# EAGLE design d100_zm1000_rev_b (EAGLE 6.1)
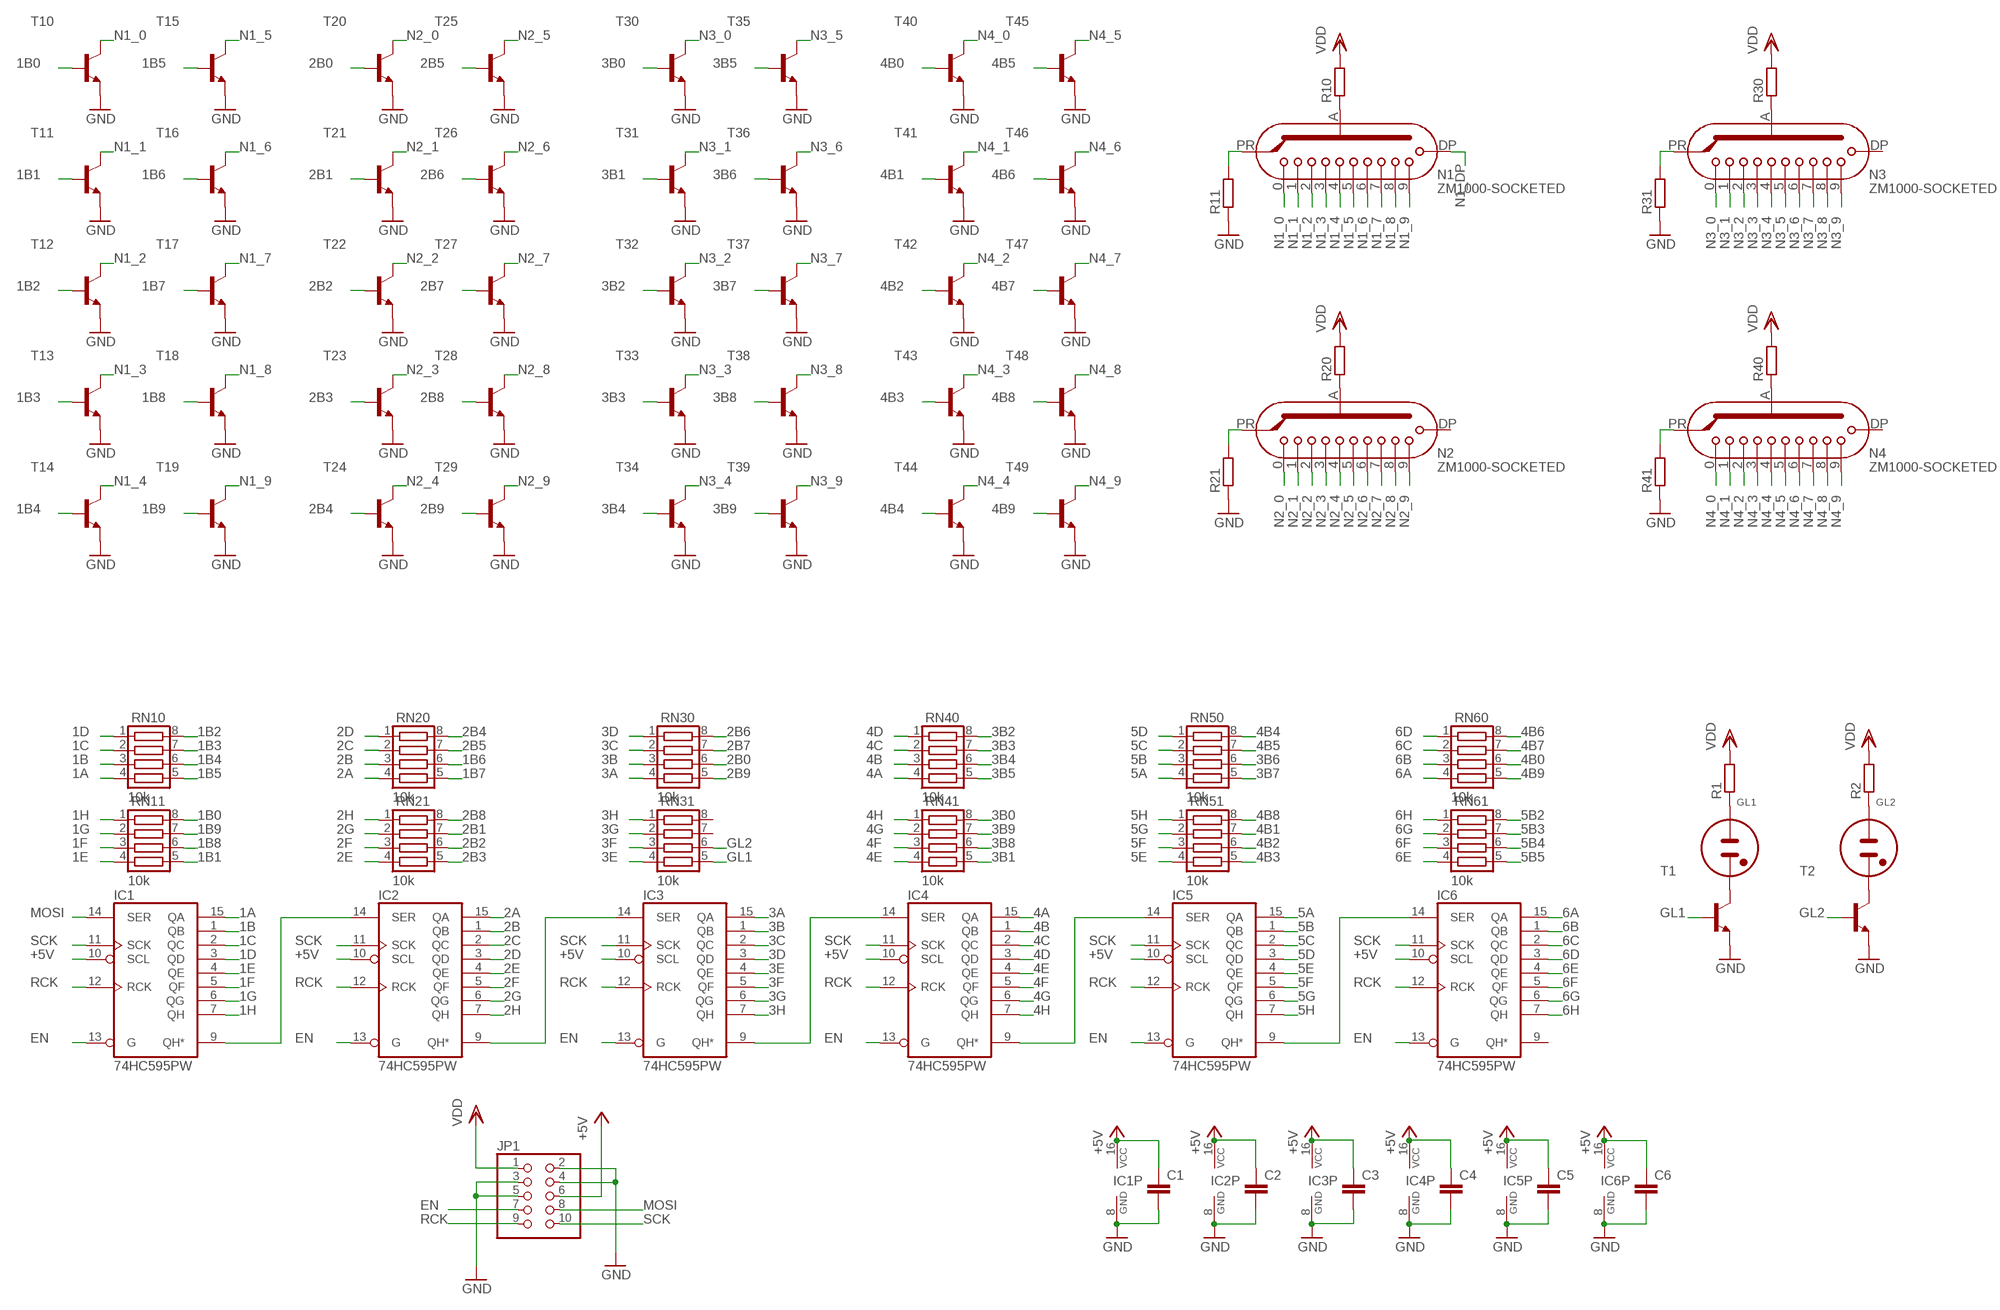
[diagram p0: schematic, sheet 1]

## Parts
C1  C-EUC0603  [C0603]
C2  C-EUC0603  [C0603]
C3  C-EUC0603  [C0603]
C4  C-EUC0603  [C0603]
C5  C-EUC0603  [C0603]
C6  C-EUC0603  [C0603]
GL1  NE2-NEON-BULB-DRILL  [NE2-NEON-BULB-DRILL]
GL2  NE2-NEON-BULB-DRILL  [NE2-NEON-BULB-DRILL]
IC1  74HC595PW  [TSSOP16]
IC2  74HC595PW  [TSSOP16]
IC3  74HC595PW  [TSSOP16]
IC4  74HC595PW  [TSSOP16]
IC5  74HC595PW  [TSSOP16]
IC6  74HC595PW  [TSSOP16]
JP1  PINHD-2X5_2.54-SMD  [2X05SMD]
N1  ZM1000-SOCKETED  [ZM1000-SOCKETED]
N2  ZM1000-SOCKETED  [ZM1000-SOCKETED]
N3  ZM1000-SOCKETED  [ZM1000-SOCKETED]
N4  ZM1000-SOCKETED  [ZM1000-SOCKETED]
R1  R-EU_R0603  [R0603]
R2  R-EU_R0603  [R0603]
R10  R-EU_R0603  [R0603]
R11  R-EU_R0603  [R0603]
R20  R-EU_R0603  [R0603]
R21  R-EU_R0603  [R0603]
R30  R-EU_R0603  [R0603]
R31  R-EU_R0603  [R0603]
R40  R-EU_R0603  [R0603]
R41  R-EU_R0603  [R0603]
RN10  10k  CTS742C083  [CTS742C083]
RN11  10k  CTS742C083  [CTS742C083]
RN20  10k  CTS742C083  [CTS742C083]
RN21  10k  CTS742C083  [CTS742C083]
RN30  10k  CTS742C083  [CTS742C083]
RN31  10k  CTS742C083  [CTS742C083]
RN40  10k  CTS742C083  [CTS742C083]
RN41  10k  CTS742C083  [CTS742C083]
RN50  10k  CTS742C083  [CTS742C083]
RN51  10k  CTS742C083  [CTS742C083]
RN60  10k  CTS742C083  [CTS742C083]
RN61  10k  CTS742C083  [CTS742C083]
T1  SMBTA42  [SOT23]
T2  SMBTA42  [SOT23]
T10  SMBTA42  [SOT23]
T11  SMBTA42  [SOT23]
T12  SMBTA42  [SOT23]
T13  SMBTA42  [SOT23]
T14  SMBTA42  [SOT23]
T15  SMBTA42  [SOT23]
T16  SMBTA42  [SOT23]
T17  SMBTA42  [SOT23]
T18  SMBTA42  [SOT23]
T19  SMBTA42  [SOT23]
T20  SMBTA42  [SOT23]
T21  SMBTA42  [SOT23]
T22  SMBTA42  [SOT23]
T23  SMBTA42  [SOT23]
T24  SMBTA42  [SOT23]
T25  SMBTA42  [SOT23]
T26  SMBTA42  [SOT23]
T27  SMBTA42  [SOT23]
T28  SMBTA42  [SOT23]
T29  SMBTA42  [SOT23]
T30  SMBTA42  [SOT23]
T31  SMBTA42  [SOT23]
T32  SMBTA42  [SOT23]
T33  SMBTA42  [SOT23]
T34  SMBTA42  [SOT23]
T35  SMBTA42  [SOT23]
T36  SMBTA42  [SOT23]
T37  SMBTA42  [SOT23]
T38  SMBTA42  [SOT23]
T39  SMBTA42  [SOT23]
T40  SMBTA42  [SOT23]
T41  SMBTA42  [SOT23]
T42  SMBTA42  [SOT23]
T43  SMBTA42  [SOT23]
T44  SMBTA42  [SOT23]
T45  SMBTA42  [SOT23]
T46  SMBTA42  [SOT23]
T47  SMBTA42  [SOT23]
T48  SMBTA42  [SOT23]
T49  SMBTA42  [SOT23]

## Nets
1A: IC1.15(QA) RN10.4
1B: IC1.1(QB) RN10.3
1B0: RN11.8 T10.1(B)
1B1: RN11.5 T11.1(B)
1B2: RN10.8 T12.1(B)
1B3: RN10.7 T13.1(B)
1B4: RN10.6 T14.1(B)
1B5: RN10.5 T15.1(B)
1B6: RN20.6 T16.1(B)
1B7: RN20.5 T17.1(B)
1B8: RN11.6 T18.1(B)
1B9: RN11.7 T19.1(B)
1C: IC1.2(QC) RN10.2
1D: IC1.3(QD) RN10.1
1E: IC1.4(QE) RN11.4
1F: IC1.5(QF) RN11.3
1G: IC1.6(QG) RN11.2
1H: IC1.7(QH) RN11.1
2A: IC2.15(QA) RN20.4
2B: IC2.1(QB) RN20.3
2B0: RN30.6 T20.1(B)
2B1: RN21.7 T21.1(B)
2B2: RN21.6 T22.1(B)
2B3: RN21.5 T23.1(B)
2B4: RN20.8 T24.1(B)
2B5: RN20.7 T25.1(B)
2B6: RN30.8 T26.1(B)
2B7: RN30.7 T27.1(B)
2B8: RN21.8 T28.1(B)
2B9: RN30.5 T29.1(B)
2C: IC2.2(QC) RN20.2
2D: IC2.3(QD) RN20.1
2E: IC2.4(QE) RN21.4
2F: IC2.5(QF) RN21.3
2G: IC2.6(QG) RN21.2
2H: IC2.7(QH) RN21.1
3A: IC3.15(QA) RN30.4
3B: IC3.1(QB) RN30.3
3B0: RN41.8 T30.1(B)
3B1: RN41.5 T31.1(B)
3B2: RN40.8 T32.1(B)
3B3: RN40.7 T33.1(B)
3B4: RN40.6 T34.1(B)
3B5: RN40.5 T35.1(B)
3B6: RN50.6 T36.1(B)
3B7: RN50.5 T37.1(B)
3B8: RN41.6 T38.1(B)
3B9: RN41.7 T39.1(B)
3C: IC3.2(QC) RN30.2
3D: IC3.3(QD) RN30.1
3E: IC3.4(QE) RN31.4
3F: IC3.5(QF) RN31.3
3G: IC3.6(QG) RN31.2
3H: IC3.7(QH) RN31.1
4A: IC4.15(QA) RN40.4
4B: IC4.1(QB) RN40.3
4B0: RN60.6 T40.1(B)
4B1: RN51.7 T41.1(B)
4B2: RN51.6 T42.1(B)
4B3: RN51.5 T43.1(B)
4B4: RN50.8 T44.1(B)
4B5: RN50.7 T45.1(B)
4B6: RN60.8 T46.1(B)
4B7: RN60.7 T47.1(B)
4B8: RN51.8 T48.1(B)
4B9: RN60.5 T49.1(B)
4C: IC4.2(QC) RN40.2
4D: IC4.3(QD) RN40.1
4E: IC4.4(QE) RN41.4
4F: IC4.5(QF) RN41.3
4G: IC4.6(QG) RN41.2
4H: IC4.7(QH) RN41.1
5A: IC5.15(QA) RN50.4
5B: IC5.1(QB) RN50.3
5B2: RN61.8
5B3: RN61.7
5B4: RN61.6
5B5: RN61.5
5C: IC5.2(QC) RN50.2
5D: IC5.3(QD) RN50.1
5E: IC5.4(QE) RN51.4
5F: IC5.5(QF) RN51.3
5G: IC5.6(QG) RN51.2
5H: IC5.7(QH) RN51.1
6A: IC6.15(QA) RN60.4
6B: IC6.1(QB) RN60.3
6C: IC6.2(QC) RN60.2
6D: IC6.3(QD) RN60.1
6E: IC6.4(QE) RN61.4
6F: IC6.5(QF) RN61.3
6G: IC6.6(QG) RN61.2
6H: IC6.7(QH) RN61.1
+5V: C1.1 C2.1 C3.1 C4.1 C5.1 C6.1 IC1.10(SCL) IC1.16(VCC) IC2.10(SCL) IC2.16(VCC) IC3.10(SCL) IC3.16(VCC) IC4.10(SCL) IC4.16(VCC) IC5.10(SCL) IC5.16(VCC) IC6.10(SCL) IC6.16(VCC) JP1.6
EN: IC1.13(G) IC2.13(G) IC3.13(G) IC4.13(G) IC5.13(G) IC6.13(G) JP1.7
GL1: RN31.5 T1.1(B)
GL2: RN31.6 T2.1(B)
GND: C1.2 C2.2 C3.2 C4.2 C5.2 C6.2 IC1.8(GND) IC2.8(GND) IC3.8(GND) IC4.8(GND) IC5.8(GND) IC6.8(GND) JP1.2 JP1.3 JP1.4 JP1.5 R11.1 R21.1 R31.1 R41.1 T1.2(E) T2.2(E) T10.2(E) T11.2(E) T12.2(E) T13.2(E) T14.2(E) T15.2(E) T16.2(E) T17.2(E) T18.2(E) T19.2(E) T20.2(E) T21.2(E) T22.2(E) T23.2(E) T24.2(E) T25.2(E) T26.2(E) T27.2(E) T28.2(E) T29.2(E) T30.2(E) T31.2(E) T32.2(E) T33.2(E) T34.2(E) T35.2(E) T36.2(E) T37.2(E) T38.2(E) T39.2(E) T40.2(E) T41.2(E) T42.2(E) T43.2(E) T44.2(E) T45.2(E) T46.2(E) T47.2(E) T48.2(E) T49.2(E)
MOSI: IC1.14(SER) JP1.8
N1_0: N1.K0 T10.3(C)
N1_1: N1.K1 T11.3(C)
N1_2: N1.K2 T12.3(C)
N1_3: N1.K3 T13.3(C)
N1_4: N1.K4 T14.3(C)
N1_5: N1.K5 T15.3(C)
N1_6: N1.K6 T16.3(C)
N1_7: N1.K7 T17.3(C)
N1_8: N1.K8 T18.3(C)
N1_9: N1.K9 T19.3(C)
N1_DP: N1.KDP(DP)
N1_PR: N1.PR R11.2
N2_0: N2.K0 T20.3(C)
N2_1: N2.K1 T21.3(C)
N2_2: N2.K2 T22.3(C)
N2_3: N2.K3 T23.3(C)
N2_4: N2.K4 T24.3(C)
N2_5: N2.K5 T25.3(C)
N2_6: N2.K6 T26.3(C)
N2_7: N2.K7 T27.3(C)
N2_8: N2.K8 T28.3(C)
N2_9: N2.K9 T29.3(C)
N3_0: N3.K0 T30.3(C)
N3_1: N3.K1 T31.3(C)
N3_2: N3.K2 T32.3(C)
N3_3: N3.K3 T33.3(C)
N3_4: N3.K4 T34.3(C)
N3_5: N3.K5 T35.3(C)
N3_6: N3.K6 T36.3(C)
N3_7: N3.K7 T37.3(C)
N3_8: N3.K8 T38.3(C)
N3_9: N3.K9 T39.3(C)
N4_0: N4.K0 T40.3(C)
N4_1: N4.K1 T41.3(C)
N4_2: N4.K2 T42.3(C)
N4_3: N4.K3 T43.3(C)
N4_4: N4.K4 T44.3(C)
N4_5: N4.K5 T45.3(C)
N4_6: N4.K6 T46.3(C)
N4_7: N4.K7 T47.3(C)
N4_8: N4.K8 T48.3(C)
N4_9: N4.K9 T49.3(C)
N$1: GL2.1(A) R2.1
N$4: N1.A1(A) N1.A2(A) R10.1
N$5: GL2.2(A1) T2.3(C)
N$6: GL1.2(A1) T1.3(C)
N$9: N2.A1(A) N2.A2(A) R20.1
N$10: IC1.9(QH*) IC2.14(SER)
N$11: IC2.9(QH*) IC3.14(SER)
N$12: IC3.9(QH*) IC4.14(SER)
N$13: N3.A1(A) N3.A2(A) R30.1
N$14: N4.A1(A) N4.A2(A) R40.1
N$16: IC4.9(QH*) IC5.14(SER)
N$18: IC5.9(QH*) IC6.14(SER)
N$21: GL1.1(A) R1.1
N$26: N3.PR R31.2
N$27: N2.PR R21.2
N$29: N4.PR R41.2
RCK: IC1.12(RCK) IC2.12(RCK) IC3.12(RCK) IC4.12(RCK) IC5.12(RCK) IC6.12(RCK) JP1.9
SCK: IC1.11(SCK) IC2.11(SCK) IC3.11(SCK) IC4.11(SCK) IC5.11(SCK) IC6.11(SCK) JP1.10
VDD: JP1.1 R1.2 R2.2 R10.2 R20.2 R30.2 R40.2
Unconnected: IC6.9(QH*) N2.KDP(DP) N3.KDP(DP) N4.KDP(DP) RN31.7 RN31.8

## Library data of the parts
C1-C6 = rcl:C-EU: CAPACITOR, European symbol
GL1 GL2 = nixie_tube:NE2-NEON-BULB: Neon indicator (wire connection)
IC1-IC6 = 74xx-eu:74*595: 8-bit SHIFT REGISTER, output latch
JP1 = con-pinhead:PINHD-2X5: PIN HEADER
N1-N4 = nixietubes-western:ZM1000: Cold cathode, neon filled, side viewing indicator tubes with long life expectancy. The ZM1000R is coated with a red filter to improve the contrast of display. These tubes incorporate a decimal point and are fitted with a pin base to suid the standard grid (2.54mm). A primer allows ionisation without delay in strobe type or blanking applications. Numeral height: 14 mm Minimum distance between mounting centres: 19 mm Numerals: 1 2 3 4 5 6 7 8 9 0 Decimal point: to the left of the numerals Cathode current, average: 2.5 mA, maximum peak: 12mA Minimum supply voltage: 170 V
R1 R2 R10 R11 R20 R21 R30 R31 R40 R41 = rcl:R-EU_: RESISTOR, European symbol
RN10 RN11 RN20 RN21 RN30 RN31 RN40 RN41 RN50 RN51 RN60 RN61 = resistor-net:CTS742C083: Chip Resistor Array 4 Single Resistor Source: http://www.ctscorp.com/components/Datasheets/CTSChipArrayDs.pdf; OC_FARNELL: unknown; OC_NEWARK: unknown
T1 T2 T10-T49 = transistor-hv:SMBTA42

## Board
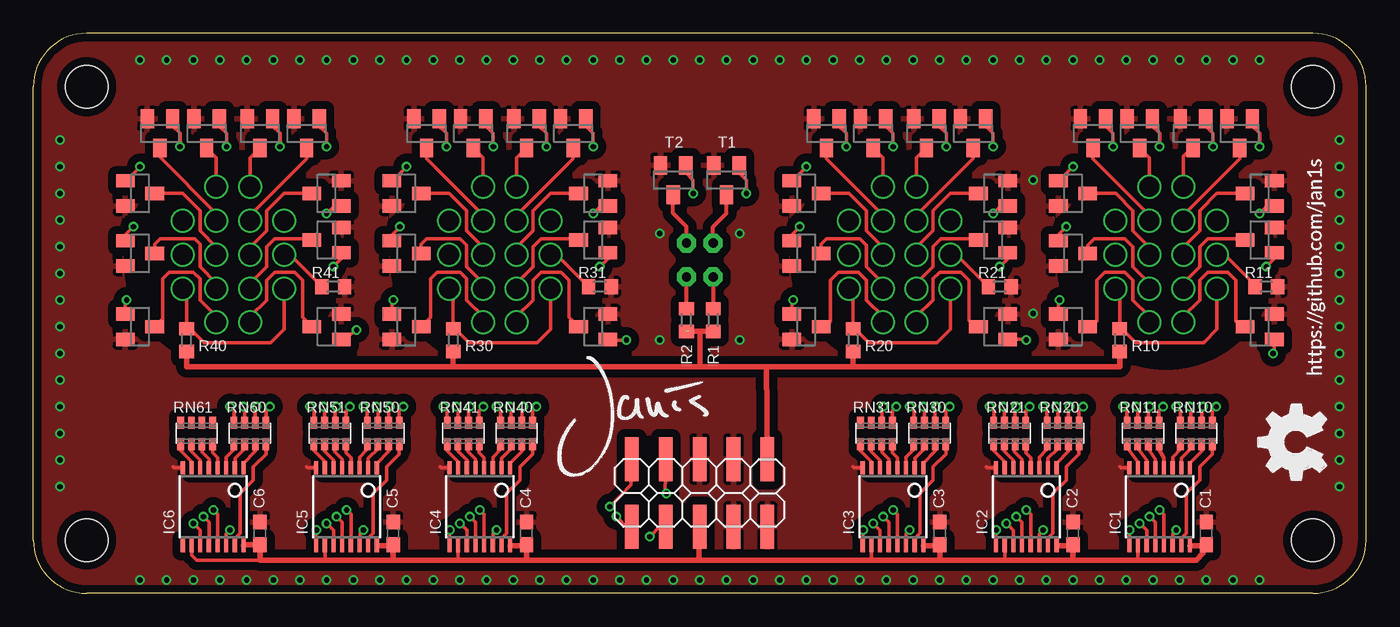
[diagram p1: board, top side]
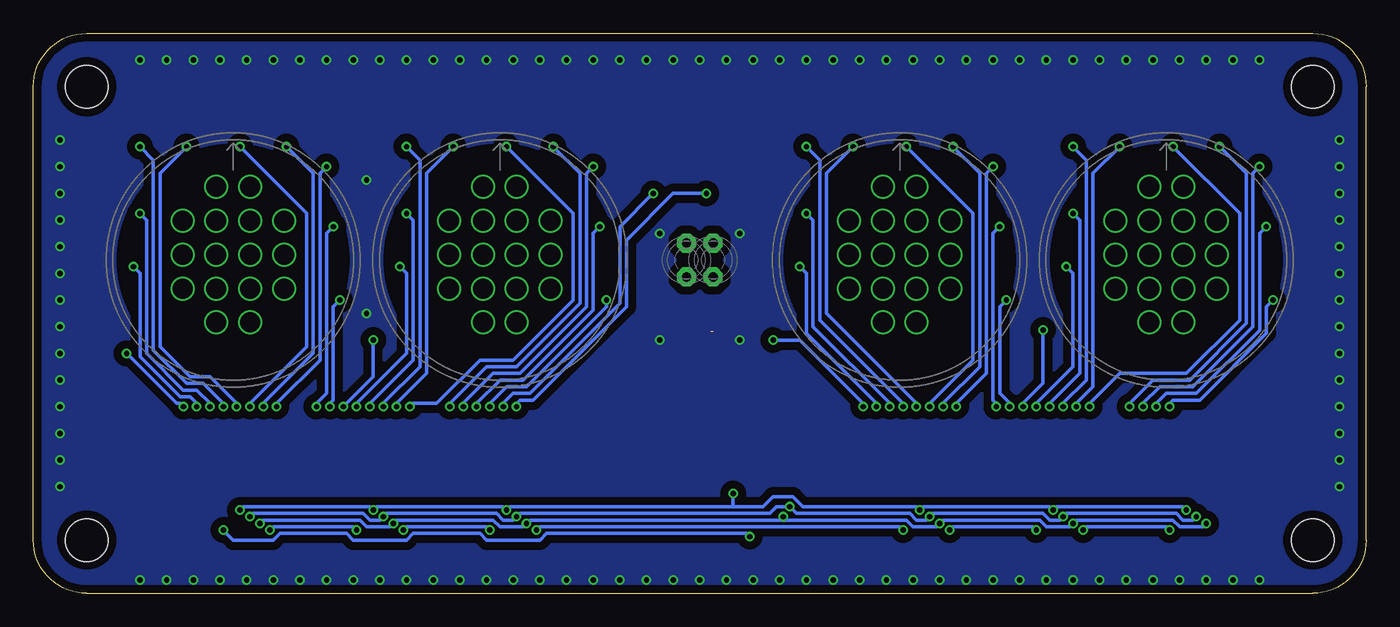
[diagram p2: board, bottom side, seen from below]

Size 100 x 42 mm. Coordinates in mm from the lower left corner, seen from the top.
Outline: 96,0 4,0 arc-90 0,4 0,38 arc-90 4,42 96,42 arc-90 100,38 100,4 arc-90 96,0
Copper layers (1*16): Top 0.035mm / dielectric 1.5mm / Bottom 0.035mm
Design rules: minimum track width 6mil, minimum drill 12mil, track to track 6mil, track to pad 6mil, pad to pad 6mil, via to via 6mil, smd to smd 0mil, copper to edge 10mil, drill to drill 10mil, minimum pad ring 6mil, minimum via ring 6mil, stop-mask expansion 2mil, vias tented up to drill 100mil, thermal gap 10mil
Holes 3.2 mm at 96,4 96,38 4,38 4,4
tRestrict: area 7.5,17.5 to 22.5,32.5; area 27.5,17.5 to 42.5,32.5; area 57.5,17.5 to 72.5,32.5; area 77.5,17.5 to 92.5,32.5
bRestrict: area 7,17 to 23,33; area 27,17 to 43,33; area 57,17 to 73,33; area 77,17 to 93,33

### Footprints (pad centres in the part's own frame; a part is rotated, then mirrored left to right if it is on the bottom)
C0603 = smd 1.1 x 1: 1 -0.85,0; 2 0.85,0
NE2-NEON-BULB-DRILL = drill 0.7 pad 1.422 octagon: 1 0,1.27; 2 0,-1.27
TSSOP16 = smd 0.305 x 0.991: 1 -2.275,-2.918; 2 -1.625,-2.918; 3 -0.975,-2.918; 4 -0.325,-2.918; 5 0.325,-2.918; 6 0.975,-2.918; 7 1.625,-2.918; 8 2.275,-2.918; 9 2.275,2.918; 10 1.625,2.918; 11 0.975,2.918; 12 0.325,2.918; 13 -0.325,2.918; 14 -0.975,2.918; 15 -1.625,2.918; 16 -2.275,2.918
2X05SMD = smd 1.016 x 3.302: 1 -1.27,-3.81; 2 -1.27,1.27; 3 1.27,-3.81; 4 1.27,1.27; 5 3.81,-3.81; 6 3.81,1.27; 7 6.35,-3.81; 8 6.35,1.27; 9 8.89,-3.81; 10 8.89,1.27
ZM1000-SOCKETED = drill 1.5 pad 1.8: A1 -3.81,-2.14; A2 3.81,-2.14; IC1 -3.81,2.94; IC2 3.81,2.94; K0 1.27,0.4; K1 -1.27,5.48; K2 -1.27,2.94; K3 -1.27,0.4; K4 -1.27,-2.14; K5 -1.27,-4.68; K6 1.27,-4.68; K7 1.27,-2.14; K8 1.27,5.48; K9 1.27,2.94; KDP 3.81,0.4; PR -3.81,0.4
R0603 = smd 1 x 1.1: 1 -0.85,0; 2 0.85,0
CTS742C083 = smd 0.5 x 0.9: 1 -1.2,-0.8; 2 -0.4,-0.8; 3 0.4,-0.8; 4 1.2,-0.8; 5 1.2,0.8; 6 0.4,0.8; 7 -0.4,0.8; 8 -1.2,0.8
SOT23 = smd 1 x 1.4: 1 -0.95,-1.1; 2 0.95,-1.1; 3 0,1.1

### Placement (x,y rotation side)
C1  88,4.5 90 top
C2  78,4.5 90 top
C3  68,4.5 90 top
C4  37,4.5 90 top
C5  27,4.5 90 top
C6  17,4.5 90 top
GL1  51,25 180 bottom
GL2  49,25 180 bottom
IC1  84.5,6.5 180 top
IC2  74.5,6.5 180 top
IC3  64.5,6.5 180 top
IC4  33.5,6.5 180 top
IC5  23.5,6.5 180 top
IC6  13.5,6.5 180 top
JP1  53.8,6.25 180 top
N1  85,25 0 bottom
N2  65,25 0 bottom
N3  35,25 0 bottom
N4  15,25 0 bottom
R1  51,20.5 270 top
R2  49,20.5 270 top
R10  81.5,19 270 top
R11  92.5,23 180 top
R20  61.5,19 270 top
R21  72.5,23 180 top
R30  31.5,19 270 top
R31  42.5,23 180 top
R40  11.5,19 270 top
R41  22.5,23 180 top
RN10  87.25,12 0 top
RN11  83.25,12 0 top
RN20  77.25,12 0 top
RN21  73.25,12 0 top
RN30  67.25,12 0 top
RN31  63.25,12 0 top
RN40  36.25,12 0 top
RN41  32.25,12 0 top
RN50  26.25,12 0 top
RN51  22.25,12 0 top
RN60  16.25,12 0 top
RN61  12.25,12 0 top
T1  52,31 180 top
T2  48,31 180 top
T10  78,30 270 top
T11  87,34.5 180 top
T12  90.5,34.5 180 top
T13  92,30 90 top
T14  92,26.5 90 top
T15  92,20 90 top
T16  78,20 270 top
T17  78,25.5 270 top
T18  83,34.5 180 top
T19  79.5,34.5 180 top
T20  58,30 270 top
T21  67,34.5 180 top
T22  70.5,34.5 180 top
T23  72,30 90 top
T24  72,26.5 90 top
T25  72,20 90 top
T26  58,20 270 top
T27  58,25.5 270 top
T28  63,34.5 180 top
T29  59.5,34.5 180 top
T30  28,30 270 top
T31  37,34.5 180 top
T32  40.5,34.5 180 top
T33  42,30 90 top
T34  42,26.5 90 top
T35  42,20 90 top
T36  28,20 270 top
T37  28,25.5 270 top
T38  33,34.5 180 top
T39  29.5,34.5 180 top
T40  8,30 270 top
T41  17,34.5 180 top
T42  20.5,34.5 180 top
T43  22,30 90 top
T44  22,26.5 90 top
T45  22,20 90 top
T46  8,20 270 top
T47  8,25.5 270 top
T48  13,34.5 180 top
T49  9.5,34.5 180 top
U$1  [GITHUB/JAN1S]  96.75,16.25 90 top
U$2  [JANIS_10MM]  39,8.5 0 top
U$3  [OSHW_FILLX200_NOTEXT]  97,8.5 90 top

### Tracks (layer width: path | path; a pad name or v marks a point on that pad's centre or on a via)
1A
  Top 0.254: RN10.4 88.45,10.45 87.5,9.5 87.5,8.5 86.5,7.5 86.5,4.5 86.12,4.12 IC1.15
1B
  Top 0.254: 87.69,11.15 RN10.3 87.65,10.65 86.78,9.78 IC1.1
1B0  (via drill 0.4)
  Top 0.254: RN11.8 82.05,13.7 v81.75,14 | T10.1 76.95,30.95 v78,32
  Bottom 0.254: v78,32 78.5,31.5 78.5,17.5 81.75,14.25 v81.75,14
1B1  (via drill 0.4)
  Top 0.254: T11.1 87.95,35.05 88.5,34.5 v88.5,33.5 | RN11.5 84.45,13.7 v84.75,14
  Bottom 0.254: v88.5,33.5 90.5,31.5 90.5,18.5 88.25,16.25 86.75,16.25 84.75,14.25 v84.75,14
1B2  (via drill 0.4)
  Top 0.254: T12.1 91.45,35.05 92,34.5 v92,33.5 | RN10.8 86.05,13.7 v85.75,14
  Bottom 0.254: v92,33.5 91,32.5 91,18.25 88.5,15.75 87.25,15.75 85.75,14.25 v85.75,14
1B3  (via drill 0.4)
  Top 0.254: RN10.7 86.85,13.9 v86.75,14 | T13.1 92.55,29.05 v92,28.5
  Bottom 0.254: v86.75,14 86.75,14.25 87.75,15.25 88.75,15.25 91.5,18 91.5,28 v92,28.5
1B4  (via drill 0.4)
  Top 0.254: RN10.6 87.65,13.9 v87.75,14 | T14.1 93.1,25.1 v92.5,24.5
  Bottom 0.254: v87.75,14 87.75,14.25 88.25,14.75 89,14.75 92,17.75 92,24 v92.5,24.5
1B5  (via drill 0.4)
  Top 0.254: RN10.5 88.45,13.7 v88.75,14 | T15.1 93.1,18.1 v93,18
  Bottom 0.254: v93,18 89.25,14.25 89,14.25 v88.75,14
1B6  (via drill 0.4)
  Top 0.254: RN20.6 77.65,13.9 v77.75,14 | T16.1 76.9,21.9 v77,22
  Bottom 0.254: v77,22 77.5,21.5 77.5,14.5 77.75,14.25 v77.75,14
1B7  (via drill 0.4)
  Top 0.254: RN20.5 78.45,13.7 v78.75,14 | T17.1 76.9,26.9 v77.5,27.5
  Bottom 0.254: v77.5,27.5 78,27 78,15 78.75,14.25 v78.75,14
1B8  (via drill 0.4)
  Top 0.254: T18.1 83.95,35.05 84.5,34.5 v84.5,33.5 | RN11.6 83.65,13.9 v83.75,14
  Bottom 0.254: v84.5,33.5 79.5,28.5 79.5,18.5 83.75,14.25 v83.75,14
1B9  (via drill 0.4)
  Top 0.254: T19.1 80.45,35.05 81,34.5 v81,33.5 | RN11.7 82.85,13.9 v82.75,14
  Bottom 0.254: v81,33.5 79,31.5 79,18 82.75,14.25 v82.75,14
1C
  Top 0.254: IC1.2 86.12,10.12 86.85,10.85 RN10.2
1D
  Top 0.254: IC1.3 85.47,10.22 86.05,10.8 RN10.1
1E
  Top 0.254: IC1.4 84.83,10.18 84.45,10.8 RN11.4
1F
  Top 0.254: IC1.5 84.17,10.07 83.65,10.85 RN11.3
1G
  Top 0.254: IC1.6 83.53,9.97 82.85,10.9 RN11.2
1H
  Top 0.254: IC1.7 82.88,9.88 82.05,10.95 RN11.1
2A
  Top 0.254: RN20.4 78.45,10.45 77.5,9.5 77.5,8.5 76.5,7.5 76.5,4.5 76.12,4.12 IC2.15
2B
  Top 0.254: 77.69,11.15 RN20.3 77.65,10.65 76.78,9.78 IC2.1
2B0  (via drill 0.4)
  Top 0.254: RN30.6 67.65,13.9 v67.75,14 | T20.1 56.95,30.95 v58,32
  Bottom 0.254: v58,32 58.5,31.5 58.5,21.5 63.5,16.5 65.5,16.5 67.75,14.25 v67.75,14
2B1  (via drill 0.4)
  Top 0.254: T21.1 67.95,35.05 68.5,34.5 v68.5,33.5 | RN21.7 72.85,13.9 v72.75,14
  Bottom 0.254: v68.5,33.5 70.5,31.5 70.5,16.5 72.75,14.25 v72.75,14
2B2  (via drill 0.4)
  Top 0.254: T22.1 71.45,35.05 72,34.5 v72,33.5 | RN21.6 73.65,13.9 v73.75,14
  Bottom 0.254: v72,33.5 71,32.5 71,17 73.75,14.25 v73.75,14
2B3  (via drill 0.4)
  Top 0.254: T23.1 72.55,29.05 v72,28.5 | RN21.5 74.45,13.7 v74.75,14
  Bottom 0.254: v72,28.5 71.5,28 71.5,17.5 74.75,14.25 v74.75,14
2B4  (via drill 0.4)
  Top 0.254: RN20.8 76.05,13.7 v75.75,14 | T24.1 73.1,25.1 v72.5,24.5
  Bottom 0.254: v72.5,24.5 72,24 72,18 75.75,14.25 v75.75,14
2B5  (via drill 0.4)
  Top 0.254: 73.1,19.1 T25.1 74.45,19.05 v74.5,19 | RN20.7 76.85,13.9 v76.75,14
  Bottom 0.254: v74.5,19 74.5,16.25 v76.75,14
2B6  (via drill 0.4)
  Top 0.254: RN30.8 66.05,13.7 v65.75,14 | T26.1 56.9,21.9 v57,22
  Bottom 0.254: v57,22 57,21.5 63,15.5 64.5,15.5 65.75,14.25 v65.75,14
2B7  (via drill 0.4)
  Top 0.254: RN30.7 66.85,13.9 v66.75,14 | T27.1 56.9,26.9 v57.5,27.5
  Bottom 0.254: v57.5,27.5 58,27 58,21.25 63.25,16 65,16 66.75,14.25 v66.75,14
2B8  (via drill 0.4)
  Top 0.254: T28.1 63.95,35.05 64.5,34.5 v64.5,33.5 | RN21.8 72.05,13.7 v71.75,14
  Bottom 0.254: v64.5,33.5 59.5,28.5 59.5,22 64,17.5 66.5,17.5 69.75,14.25 71.5,14.25 v71.75,14
2B9  (via drill 0.4)
  Top 0.254: T29.1 60.45,35.05 61,34.5 v61,33.5 | RN30.5 68.45,13.7 v68.75,14
  Bottom 0.254: v61,33.5 59,31.5 59,21.75 63.75,17 66,17 68.75,14.25 v68.75,14
2C
  Top 0.254: IC2.2 76.12,10.12 76.85,10.85 RN20.2
2D
  Top 0.254: IC2.3 75.47,10.22 76.05,10.8 RN20.1
2E
  Top 0.254: RN21.4 74.45,10.55 74.83,10.18 IC2.4
2F
  Top 0.254: RN21.3 73.61,11.16 73.61,10.63 74.17,10.07 IC2.5
2G
  Top 0.254: RN21.2 72.85,10.65 73.53,9.97 IC2.6
2H
  Top 0.254: RN21.1 72.05,10.7 72.88,9.88 IC2.7
3A
  Top 0.254: RN30.4 68.45,10.45 67.5,9.5 67.5,8.5 66.5,7.5 66.5,4.5 66.12,4.12 IC3.15
3B
  Top 0.254: 67.69,11.15 RN30.3 67.65,10.65 66.78,9.78 IC3.1
3B0  (via drill 0.4)
  Top 0.254: T30.1 26.95,30.95 v28,32 | RN41.8 31.05,13.7 v30.75,14
  Bottom 0.254: v28,32 28.5,31.5 28.5,16.5 30.75,14.25 v30.75,14
3B1  (via drill 0.4)
  Top 0.254: T31.1 37.95,35.05 38.5,34.5 v38.5,33.5 | RN41.5 33.45,13.7 v33.75,14
  Bottom 0.254: v38.5,33.5 40.5,31.5 40.5,21 33.75,14.25 v33.75,14
3B2  (via drill 0.4)
  Top 0.254: T32.1 41.45,35.05 42,34.5 v42,33.5 | RN40.8 35.05,13.7 v34.75,14
  Bottom 0.254: v42,33.5 41,32.5 41,20.5 34.75,14.25 v34.75,14
3B3  (via drill 0.4)
  Top 0.254: T33.1 42.55,29.05 v42,28.5 | RN40.7 35.85,13.9 v35.75,14
  Bottom 0.254: v42,28.5 41.5,28 41.5,20 35.75,14.25 v35.75,14
3B4  (via drill 0.4)
  Top 0.254: T34.1 43.1,25.1 v42.5,24.5 | RN40.6 36.65,13.9 v36.75,14
  Bottom 0.254: v42.5,24.5 42,24 42,19.5 36.75,14.25 v36.75,14
3B5  (via drill 0.4)
  Top 0.254: v44.5,19 43.15,19 T35.1 | RN40.5 37.45,13.7 v37.75,14
  Bottom 0.254: v44.5,19 42.5,19 37.75,14.25 v37.75,14
3B6  (via drill 0.4)
  Top 0.254: T36.1 26.9,21.9 v27,22 | RN50.6 26.65,13.9 v26.75,14
  Bottom 0.254: v27,22 27.5,21.5 27.5,15 26.75,14.25 v26.75,14
3B7  (via drill 0.4)
  Top 0.254: T37.1 26.9,26.9 v27.5,27.5 | RN50.5 27.45,13.7 v27.75,14
  Bottom 0.254: v27.5,27.5 28,27 28,14.5 27.75,14.25 v27.75,14
3B8  (via drill 0.4)
  Top 0.254: T38.1 33.95,35.05 34.5,34.5 v34.5,33.5 | RN41.6 32.65,13.9 v32.75,14
  Bottom 0.254: v34.5,33.5 29.5,28.5 29.5,17.5 32.75,14.25 v32.75,14
3B9  (via drill 0.4)
  Top 0.254: T39.1 30.45,35.05 31,34.5 v31,33.5 | RN41.7 31.85,13.9 v31.75,14
  Bottom 0.254: v31,33.5 29,31.5 29,17 31.75,14.25 v31.75,14
3C
  Top 0.254: RN30.2 66.85,10.85 66.12,10.12 IC3.2
3D
  Top 0.254: IC3.3 65.47,10.22 66.05,10.8 RN30.1
3E
  Top 0.254: RN31.4 64.45,10.55 64.83,10.18 IC3.4
3F
  Top 0.254: RN31.3 63.65,10.6 64.17,10.07 IC3.5
3G
  Top 0.254: RN31.2 62.85,10.65 63.52,9.97 IC3.6
3H
  Top 0.254: RN31.1 62.05,10.7 62.88,9.88 IC3.7
4A
  Top 0.254: RN40.4 37.45,10.45 36.5,9.5 36.5,8.5 35.5,7.5 35.5,4.5 35.12,4.12 IC4.15
4B
  Top 0.254: 36.7,10.95 36.75,11 36.75,11.1 RN40.3 36.65,10.65 35.77,9.78 IC4.1
4B0  (via drill 0.4)
  Top 0.254: T40.1 6.95,30.95 v8,32 | RN60.6 16.65,13.9 v16.75,14
  Bottom 0.254: v8,32 8.5,31.5 8.5,20 13,15.5 15.5,15.5 16.75,14.25 v16.75,14
4B1  (via drill 0.4)
  Top 0.254: T41.1 17.95,35.05 18.5,34.5 v18.5,33.5 | RN51.7 21.85,13.9 v21.75,14
  Bottom 0.254: v18.5,33.5 20.5,31.5 20.5,15.5 21.75,14.25 v21.75,14
4B2  (via drill 0.4)
  Top 0.254: T42.1 21.45,35.05 22,34.5 v22,33.5 | RN51.6 22.65,13.9 v22.75,14
  Bottom 0.254: v22,33.5 21,32.5 21,16 22.75,14.25 v22.75,14
4B3  (via drill 0.4)
  Top 0.254: T43.1 22.55,29.05 v22,28.5 | RN51.5 23.45,13.7 v23.75,14
  Bottom 0.254: v22,28.5 21.5,28 21.5,16.5 23.75,14.25 v23.75,14
4B4  (via drill 0.4)
  Top 0.254: T44.1 23.1,25.1 v22.5,24.5 | RN50.8 25.05,13.7 v24.75,14
  Bottom 0.254: v22.5,24.5 22,24 22,17 24.75,14.25 v24.75,14
4B5  (via drill 0.4)
  Top 0.254: v24.25,19.75 23.15,19 T45.1 | RN50.7 25.85,13.9 v25.75,14
  Bottom 0.254: v25.75,14 25.75,14.25 24.25,15.75 v24.25,19.75
4B6  (via drill 0.4)
  Top 0.254: T46.1 6.9,21.9 v7,22 | RN60.8 15.05,13.7 v14.75,14
  Bottom 0.254: v7,22 7.5,21.5 7.5,19.5 12.5,14.5 14.5,14.5 14.75,14.25 v14.75,14
4B7  (via drill 0.4)
  Top 0.254: T47.1 6.9,26.9 v7.5,27.5 | RN60.7 15.85,13.9 v15.75,14
  Bottom 0.254: v7.5,27.5 8,27 8,19.75 12.75,15 15,15 15.75,14.25 v15.75,14
4B8  (via drill 0.4)
  Top 0.254: T48.1 13.95,35.05 14.5,34.5 v14.5,33.5 | RN51.8 21.05,13.7 v20.75,14
  Bottom 0.254: v14.5,33.5 9.5,28.5 9.5,20.5 13.5,16.5 18.5,16.5 20.75,14.25 v20.75,14
4B9  (via drill 0.4)
  Top 0.254: T49.1 10.45,35.05 11,34.5 v11,33.5 | RN60.5 17.45,13.7 v17.75,14
  Bottom 0.254: v11,33.5 9,31.5 9,20.25 13.25,16 16,16 17.75,14.25 v17.75,14
4C
  Top 0.254: IC4.2 35.12,10.12 35.85,10.85 RN40.2
4D
  Top 0.254: IC4.3 34.48,10.22 35.05,10.8 RN40.1
4E
  Top 0.254: RN41.4 33.45,10.55 33.83,10.18 IC4.4
4F
  Top 0.254: RN41.3 32.62,11.16 32.62,10.63 33.17,10.07 IC4.5
4G
  Top 0.254: RN41.2 31.85,10.65 32.52,9.97 IC4.6
4H
  Top 0.254: RN41.1 31.05,10.7 31.88,9.88 IC4.7
5A
  Top 0.254: RN50.4 27.45,10.45 26.5,9.5 26.5,8.5 25.5,7.5 25.5,4.5 25.12,4.12 IC5.15
5B
  Top 0.254: 26.7,11.15 RN50.3 26.65,10.65 25.77,9.78 IC5.1
5C
  Top 0.254: IC5.2 25.12,10.12 25.85,10.85 RN50.2
5D
  Top 0.254: IC5.3 24.48,10.22 25.05,10.8 RN50.1
5E
  Top 0.254: RN51.4 23.45,10.55 23.82,10.18 IC5.4
5F
  Top 0.254: RN51.3 22.61,11.16 22.61,10.63 23.18,10.07 IC5.5
5G
  Top 0.254: RN51.2 21.85,10.65 22.52,9.97 IC5.6
5H
  Top 0.254: RN51.1 21.05,10.7 21.88,9.88 IC5.7
6A
  Top 0.254: RN60.4 17.45,10.45 16.5,9.5 16.5,8.5 15.5,7.5 15.5,4.5 15.12,4.12 IC6.15
6B
  Top 0.254: IC6.1 15.78,9.78 16.65,10.65 RN60.3
6C
  Top 0.254: IC6.2 15.12,10.12 15.85,10.85 RN60.2
6D
  Top 0.254: IC6.3 14.47,10.22 15.05,10.8 RN60.1
6E
  Top 0.254: RN61.4 13.45,10.55 13.82,10.18 IC6.4
6F
  Top 0.254: RN61.3 12.65,10.6 13.18,10.07 IC6.5
6G
  Top 0.254: RN61.2 11.85,10.65 12.53,9.97 IC6.6
6H
  Top 0.254: RN61.1 11.05,10.7 11.88,9.88 IC6.7
+5V
  Top 0.254: C5.1 27,2.5 | 37,2.56 36.94,2.5 32,2.5 31.88,2.62 IC4.10 | IC5.10 21.88,2.62 22,2.5 | IC3.10 62.88,2.62 63,2.5 | IC2.10 72.88,2.62 73,2.5 | IC1.10 82.88,2.62 83,2.5 | IC6.10 11.88,2.88 12.25,2.5 17,2.5
  Top 0.406: 78,2.5 83,2.5 87.25,2.5 87.75,3 C1.1 87.93,3.58 IC1.16 | 78,2.5 73,2.5 68,2.5 | 68,2.5 63,2.5 50,2.5 | JP1.6 49.94,2.56 50,2.5 | IC6.16 15.84,3.65 C6.1 17,2.5 22,2.5 26.94,2.5 | 37,2.56 C4.1 36.93,3.58 IC4.16 | IC5.16 26.93,3.58 C5.1 27,2.56 26.94,2.5 | 26.94,2.5 27,2.5 32,2.5 50,2.5 | 68,2.5 C3.1 67.93,3.58 IC3.16 | IC2.16 77.93,3.58 C2.1 78,2.5
EN  (via drill 0.4)
  Top 0.254: IC6.13 13.82,5.92 v13.5,6.25 | IC5.13 23.82,5.92 v23.5,6.25 | IC4.13 33.83,5.92 v33.5,6.25 | IC3.13 64.83,5.92 v64.5,6.25 | JP1.7 47.4,7.6 v47.5,7.5 | IC2.13 74.83,5.92 v74.5,6.25 | IC1.13 84.83,5.92 v84.5,6.25
  Bottom 0.254: v13.5,6.25 13.75,6.5 23.25,6.5 v23.5,6.25 23.75,6.5 33.25,6.5 v33.5,6.25 33.75,6.5 42.25,6.5 43,7.25 44.5,7.25 45.25,6.5 47.5,6.5 | 47.5,6.5 64.25,6.5 v64.5,6.25 64.75,6.5 74.25,6.5 v74.5,6.25 74.75,6.5 84.25,6.5 v84.5,6.25 | 47.5,6.5 v47.5,7.5
GL1  (via drill 0.4)
  Top 0.254: T1.1 52.95,31.55 53.5,31 v53.5,30 | RN31.5 64.45,13.7 v64.75,14
  Bottom 0.254: v53.5,30 56,27.5 56,21.75 62.75,15 64,15 64.75,14.25 v64.75,14
GL2  (via drill 0.4)
  Top 0.254: T2.1 48.95,31.55 49.5,31 v49.5,30 | RN31.6 63.65,13.9 v63.75,14
  Bottom 0.254: v49.5,30 52,30 55.5,26.5 55.5,21.5 62.5,14.5 63.5,14.5 63.75,14.25 v63.75,14
GND  (via drill 0.4)
  Top 0.254: IC5.8 20.58,9.42 20.5,9.5 | IC6.8 10.58,9.42 10.5,9.5 | IC4.8 30.58,9.42 30.5,9.5 | IC3.8 61.58,9.42 61.5,9.5 | IC2.8 71.58,9.42 71.5,9.5 | IC1.8 81.58,9.42 81.5,9.5
  other vias: 53,27 53,19 47,19 47,27 75,21 75,31 2,14 2,18 2,20 2,10 2,8 92,40 90,40 88,40 86,40 84,40 82,40 80,40 78,40 76,40 74,40 72,40 70,40 68,40 66,40 64,40 62,40 60,40 58,40 56,40 54,40 52,40 50,40 48,40 46,40 44,40 42,40 40,40 38,40 36,40 34,40 32,40 30,40 28,40 26,40 24,40 22,40 20,40 18,40 16,40 14,40 12,40 10,40 8,40 92,1 90,1 88,1 86,1 84,1 82,1 80,1 78,1 76,1 74,1 72,1 70,1 68,1 66,1 64,1 62,1 60,1 58,1 56,1 54,1 52,1 50,1 48,1 46,1 44,1 42,1 40,1 38,1 36,1 34,1 32,1 30,1 28,1 26,1 24,1 22,1 20,1 18,1 16,1 14,1 12,1 10,1 8,1 98,34 98,32 98,30 98,28 98,26 98,24 98,22 98,20 98,18 98,16 98,14 98,12 98,10 98,8 2,12 2,16 2,24 2,26 2,28 2,30 2,32 2,34 2,22
  pour Top (isolate 0.61): 97,0 100,3 100,39 98,42 3,42 0,39 0,3 3,0
  pour Bottom (isolate 0.61): 97,0 100,3 100,39.5 97,42 3,42 0,39 0,3 3,0
MOSI  (via drill 0.4)
  Top 0.254: JP1.8 46.98,4.98 v46.25,4.25 | 85.5,4.5 v85.75,4.75 85.47,4.47 IC1.14
  Bottom 0.254: v46.25,4.25 46.5,4.5 61.5,4.5 62,4 66,4 66.5,4.5 71.5,4.5 72,4 76,4 76.5,4.5 81.5,4.5 82,4 85,4 v85.75,4.75
N1_0
  Top 0.254: N1.K0 83.73,25.97 82.5,27.2 82.5,28.7 81.2,30 T10.3
N1_1
  Top 0.254: N1.K1 86.27,32.77 86.9,33.4 T11.3
N1_2
  Top 0.254: N1.K2 86.27,28.37 90.5,32.6 T12.3
N1_3
  Top 0.254: N1.K3 86.27,25.97 87.5,27.2 87.5,28.7 88.8,30 T13.3
N1_4
  Top 0.254: N1.K4 86.27,23.27 87.5,24.5 87.5,26 88.1,26.6 90.7,26.6 90.8,26.5 T14.3 91,26.5
N1_5
  Top 0.254: N1.K5 86.27,20.77 87.5,22 87.5,23.5 88.1,24.1 89.6,24.1 90.2,23.5 90.2,20.4 90.6,20 T15.3
N1_6
  Top 0.254: N1.K6 83.73,20.77 82.5,22 82.5,23.5 81.9,24.1 80.4,24.1 79.8,23.5 79.8,20.4 79.4,20 T16.3
N1_7
  Top 0.254: N1.K7 83.73,23.27 82.5,24.5 82.5,26 81.9,26.6 79.6,26.6 79.1,26.1 T17.3
N1_8
  Top 0.254: N1.K8 83.73,32.67 T18.3
N1_9
  Top 0.254: N1.K9 83.73,28.37 79.5,32.6 T19.3
N1_PR
  Top 0.254: N1.PR 89.4,25.4 91.65,23.15 R11.2
N2_0
  Top 0.254: N2.K0 63.73,25.97 62.5,27.2 62.5,28.7 61.2,30 T20.3
N2_1
  Top 0.254: N2.K1 66.27,32.67 T21.3
N2_2
  Top 0.254: N2.K2 66.27,28.37 70.5,32.6 T22.3
N2_3
  Top 0.254: N2.K3 66.27,25.97 67.5,27.2 67.5,28.7 68.8,30 T23.3
N2_4
  Top 0.254: N2.K4 66.27,23.27 67.5,24.5 67.5,26 68.1,26.6 70.8,26.6 T24.3
N2_5
  Top 0.254: N2.K5 66.27,20.77 67.5,22 67.5,23.6 68,24.1 69.6,24.1 70.2,23.5 70.2,20.5 70.7,20 T25.3
N2_6
  Top 0.254: N2.K6 63.73,20.77 62.5,22 62.5,23.5 61.9,24.1 60.4,24.1 59.8,23.5 59.8,20.4 59.5,20 T26.3
N2_7
  Top 0.254: N2.K7 63.73,23.27 62.5,24.5 62.5,26.1 62,26.6 59.5,26.6 59.1,26.2 T27.3
N2_8
  Top 0.254: N2.K8 63.73,32.67 T28.3
N2_9
  Top 0.254: N2.K9 63.73,28.37 59.5,32.6 T29.3
N3_0
  Top 0.254: N3.K0 33.73,25.97 32.5,27.2 32.5,28.7 31.2,30 T30.3
N3_1
  Top 0.254: N3.K1 36.27,32.67 T31.3
N3_2
  Top 0.254: N3.K2 36.27,28.37 40.5,32.6 T32.3
N3_3
  Top 0.254: N3.K3 36.27,25.97 37.5,27.2 37.5,28.7 38.8,30 T33.3
N3_4
  Top 0.254: N3.K4 36.27,23.27 37.5,24.5 37.5,26 38.1,26.6 40.8,26.6 T34.3
N3_5
  Top 0.254: N3.K5 36.27,20.77 37.5,22 37.5,23.5 38.1,24.1 39.6,24.1 40.2,23.5 40.2,20.7 T35.3
N3_6
  Top 0.254: N3.K6 33.73,20.77 32.5,22 32.5,23.6 32,24.1 30.3,24.1 29.8,23.6 29.8,20.7 T36.3
N3_7
  Top 0.254: N3.K7 33.73,23.27 32.5,24.5 32.5,26.1 32,26.6 29.5,26.6 29.1,26.2 T37.3
N3_8
  Top 0.254: N3.K8 33.73,32.67 T38.3
N3_9
  Top 0.254: N3.K9 33.73,28.37 29.5,32.6 T39.3
N4_0
  Top 0.254: N4.K0 13.73,25.97 12.5,27.2 12.5,28.7 11.2,30 T40.3
N4_1
  Top 0.254: N4.K1 16.27,32.67 T41.3
N4_2
  Top 0.254: N4.K2 16.27,28.37 20.5,32.6 T42.3 20.5,33.5
N4_3
  Top 0.254: N4.K3 16.27,25.97 17.5,27.2 17.5,28.7 18.8,30 T43.3
N4_4
  Top 0.254: N4.K4 16.27,23.27 17.5,24.5 17.5,26 18.1,26.6 20.8,26.6 T44.3
N4_5
  Top 0.254: N4.K5 16.27,20.77 17.5,22 17.5,23.5 18.1,24.1 19.6,24.1 20.2,23.5 20.2,20.7 T45.3
N4_6
  Top 0.254: N4.K6 13.73,20.77 12.5,22 12.5,23.6 12,24.1 10.2,24.1 9.7,23.6 9.7,20.6 T46.3
N4_7
  Top 0.254: N4.K7 13.73,23.27 12.5,24.5 12.5,26.2 12.1,26.6 9.5,26.6 9.1,26.2 T47.3
N4_8
  Top 0.254: N4.K8 13.73,32.67 T48.3
N4_9
  Top 0.254: N4.K9 13.73,28.47 9.5,32.7 T49.3
N$1
  Top 0.305: R2.1 GL2.1
N$4
  Top 0.254: N1.A1 88.81,19.81 87.8,18.8 82.7,18.8 81.65,19.85 R10.1 81.5,22.5 81.19,22.81 N1.A2
N$5
  Top 0.305: GL2.2 49,27.5 48,28.5 T2.3
N$6
  Top 0.305: GL1.2 51,27.5 52,28.5 T1.3
N$9
  Top 0.254: N2.A1 68.81,19.81 67.8,18.8 62.7,18.8 61.65,19.85 R20.1 61.5,22.5 61.19,22.81 N2.A2
N$10  (via drill 0.4)
  Top 0.254: IC1.9 82.22,4.72 v82.25,4.75 | 75.5,4.5 v75.75,4.75 75.47,4.47 IC2.14
  Bottom 0.254: v82.25,4.75 82,5 76,5 v75.75,4.75
N$11  (via drill 0.4)
  Top 0.254: IC2.9 72.22,4.72 v72.25,4.75 | 65.5,4.5 v65.75,4.75 65.47,4.47 IC3.14
  Bottom 0.254: v72.25,4.75 72,5 66,5 v65.75,4.75
N$12  (via drill 0.4)
  Top 0.254: IC3.9 62.23,4.72 v62.25,4.75 | 34.5,4.5 v34.75,4.75 34.48,4.47 IC4.14
  Bottom 0.254: v62.25,4.75 62,5 35,5 v34.75,4.75
N$13
  Top 0.254: N3.A2 31.5,22.55 R30.1 31.65,19.85 32.65,18.85 32.65,18.8 37.8,18.8 38.81,19.81 N3.A1
N$14
  Top 0.254: N4.A2 11.5,22.55 R40.1 11.75,19.85 12.8,18.8 17.8,18.8 18.81,19.81 N4.A1
N$16  (via drill 0.4)
  Top 0.254: IC4.9 31.23,4.72 v31.25,4.75 | IC5.14 24.5,3.61 24.5,4.5 v24.75,4.75
  Bottom 0.254: v31.25,4.75 31,5 25,5 v24.75,4.75
N$18  (via drill 0.4)
  Top 0.254: IC5.9 21.23,4.47 v21.25,4.75 | IC6.14 14.47,4.47 v14.75,4.75
  Bottom 0.254: v14.75,4.75 15,5 21,5 v21.25,4.75
N$21
  Top 0.305: GL1.1 R1.1
N$26
  Top 0.254: N3.PR 39.25,25.4 R31.2
N$27
  Top 0.254: N2.PR 69.25,25.4 R21.2
N$29
  Top 0.254: N4.PR 19.25,25.4 R41.2
RCK  (via drill 0.4)
  Top 0.254: IC6.12 13.18,5.33 v12.75,5.75 | IC5.12 23.18,5.33 v22.75,5.75 | IC4.12 33.17,5.33 v32.75,5.75 | IC3.12 64.17,5.33 v63.75,5.75 | JP1.9 44.86,8.14 v43.25,6.5 | IC2.12 74.17,5.33 v73.75,5.75 | IC1.12 84.17,5.33 v83.75,5.75
  Bottom 0.254: v12.75,5.75 13,5.5 13.75,5.5 14.25,6 22.5,6 v22.75,5.75 23,5.5 23.75,5.5 24.25,6 32.5,6 v32.75,5.75 33,5.5 33.75,5.5 34.25,6 42.75,6 v43.25,6.5 44.25,6.5 44.75,6 63.5,6 v63.75,5.75 64,5.5 64.75,5.5 65.25,6 73.5,6 v73.75,5.75 74,5.5 74.75,5.5 75.25,6 83.5,6 v83.75,5.75
SCK  (via drill 0.4)
  Top 0.254: IC6.11 12.53,4.72 v12,5.25 | v22,5.25 22.52,4.72 IC5.11 | IC4.11 32.52,4.72 v32,5.25 | IC3.11 63.52,4.72 v63,5.25 | JP1.10 44.61,4.86 v43.75,5.75 | IC2.11 73.53,4.72 v73,5.25 | IC1.11 83.53,4.72 v83,5.25
  Bottom 0.254: v12,5.25 12.25,5 14,5 14.5,5.5 21.75,5.5 v22,5.25 22.25,5 24,5 24.5,5.5 31.75,5.5 v32,5.25 32.25,5 34,5 34.5,5.5 43.75,5.5 | 43.75,5.5 62.75,5.5 v63,5.25 63.25,5 65,5 65.5,5.5 72.75,5.5 v73,5.25 73.25,5 75,5 75.5,5.5 82.75,5.5 v83,5.25 | v43.75,5.75 43.75,5.5
VDD  (1 unrouted)
  Top 0.406: R10.2 81.5,17 61.5,17 | 61.5,18 R20.2 61.5,17 | 50,17 55,17 | 55,17 61.5,17 | 31.5,17 11.5,17 R40.2 | R1.2 50,19.65 | 50,19.65 49.15,19.65 49,19.5 | 50,17 50,19.65 | R30.2 31.5,17 | 31.5,17 50,17 | JP1.1 55.02,16.98 55,17